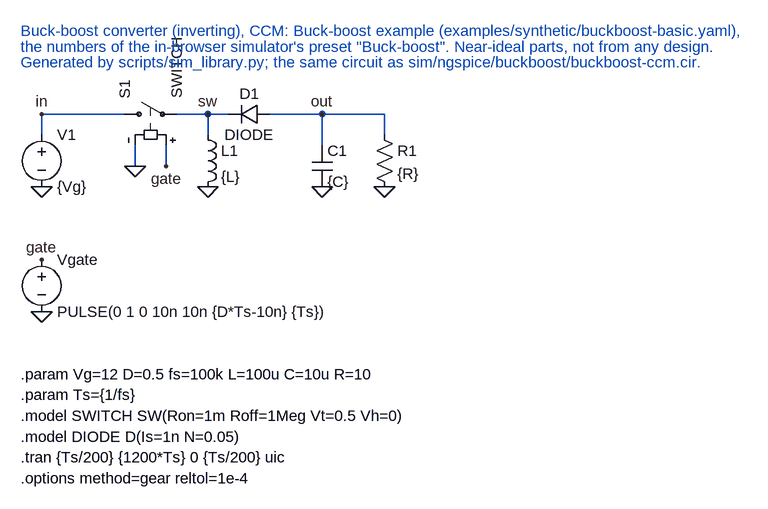
[diagram p0: schematic buckboost-ccm.asc]
buckboost-ccm.asc, the LTspice schematic file:
Version 4
SHEET 1 688 848
WIRE 0 64 0 96
WIRE 192 112 192 144
WIRE 144 112 144 144
WIRE 0 64 128 64
WIRE 208 64 256 64
WIRE 256 64 256 96
WIRE 256 64 288 64
WIRE 352 64 432 64
WIRE 432 64 432 112
WIRE 432 64 528 64
WIRE 528 64 528 96
FLAG 0 64 in
FLAG 0 176 0
FLAG 0 288 gate
FLAG 0 368 0
FLAG 192 144 gate
FLAG 144 144 0
FLAG 256 176 0
FLAG 256 64 sw
FLAG 432 176 0
FLAG 528 176 0
FLAG 432 64 out
SYMBOL voltage 0 80 R0
SYMATTR InstName V1
SYMATTR Value {Vg}
SYMBOL voltage 0 272 R0
SYMATTR InstName Vgate
SYMATTR Value PULSE(0 1 0 10n 10n {D*Ts-10n} {Ts})
SYMBOL sw 112 64 R270
SYMATTR InstName S1
SYMATTR Value SWITCH
SYMBOL ind 240 80 R0
SYMATTR InstName L1
SYMATTR Value {L}
SYMBOL diode 352 48 R90
WINDOW 0 0 32 VBottom 2
WINDOW 3 32 32 VTop 2
SYMATTR InstName D1
SYMATTR Value DIODE
SYMBOL cap 416 112 R0
SYMATTR InstName C1
SYMATTR Value {C}
SYMBOL res 512 80 R0
SYMATTR InstName R1
SYMATTR Value {R}
TEXT -32 -64 Left 2 ;Buck-boost converter (inverting), CCM: Buck-boost example (examples/synthetic/buckboost-basic.yaml),
TEXT -32 -40 Left 2 ;the numbers of the in-browser simulator's preset "Buck-boost". Near-ideal parts, not from any design.
TEXT -32 -16 Left 2 ;Generated by scripts/sim_library.py; the same circuit as sim/ngspice/buckboost/buckboost-ccm.cir.
TEXT -32 464 Left 2 !.param Vg=12 D=0.5 fs=100k L=100u C=10u R=10
TEXT -32 496 Left 2 !.param Ts={1/fs}
TEXT -32 528 Left 2 !.model SWITCH SW(Ron=1m Roff=1Meg Vt=0.5 Vh=0)
TEXT -32 560 Left 2 !.model DIODE D(Is=1n N=0.05)
TEXT -32 592 Left 2 !.tran {Ts/200} {1200*Ts} 0 {Ts/200} uic
TEXT -32 624 Left 2 !.options method=gear reltol=1e-4

The netlist it stands for:
* buckboost-ccm.asc
V1 in 0 {Vg}
Vgate gate 0 PULSE(0 1 0 10n 10n {D*Ts-10n} {Ts})
S1 in sw gate 0 SWITCH
L1 sw 0 {L}
D1 out sw DIODE
C1 out 0 {C}
R1 out 0 {R}
.model D D
.lib standard.dio
* Buck-boost converter (inverting), CCM: Buck-boost example (examples/synthetic/buckboost-basic.yaml),
* the numbers of the in-browser simulator's preset "Buck-boost". Near-ideal parts, not from any design.
* Generated by scripts/sim_library.py; the same circuit as sim/ngspice/buckboost/buckboost-ccm.cir.
.param Vg=12 D=0.5 fs=100k L=100u C=10u R=10
.param Ts={1/fs}
.model SWITCH SW(Ron=1m Roff=1Meg Vt=0.5 Vh=0)
.model DIODE D(Is=1n N=0.05)
.tran {Ts/200} {1200*Ts} 0 {Ts/200} uic
.options method=gear reltol=1e-4
.backanno
.end